# Altium schematic sheet EEM_Connectors.SchDoc: EEM
size 420 x 297 mm; EDA_Number: ARTIQ; SPICEModelCacheVGBTAUBO: <root> / <DocumentId>VGBTAUBO</DocumentId> / </root>; CheckedBy: P.Kulik; Author: G.Kasprowicz; CompanyName: WUT ISE; DrawnBy: G.Kasprowicz; Organization: WUT ISE; Address1: PW ISE; Address2: Nowowiejska 15/19 00-665 Warsaw; Address3: gkasprow@gmail.com; Revision: 2; SheetNumber: -; SheetTotal: -; ModifiedBy: -; CheckedDate: -; Title2: Connectors; DivGrp: WUT ISE; Designer: G.Kasprowicz; ModifiedDate: -; ProjectName: Sensor Box
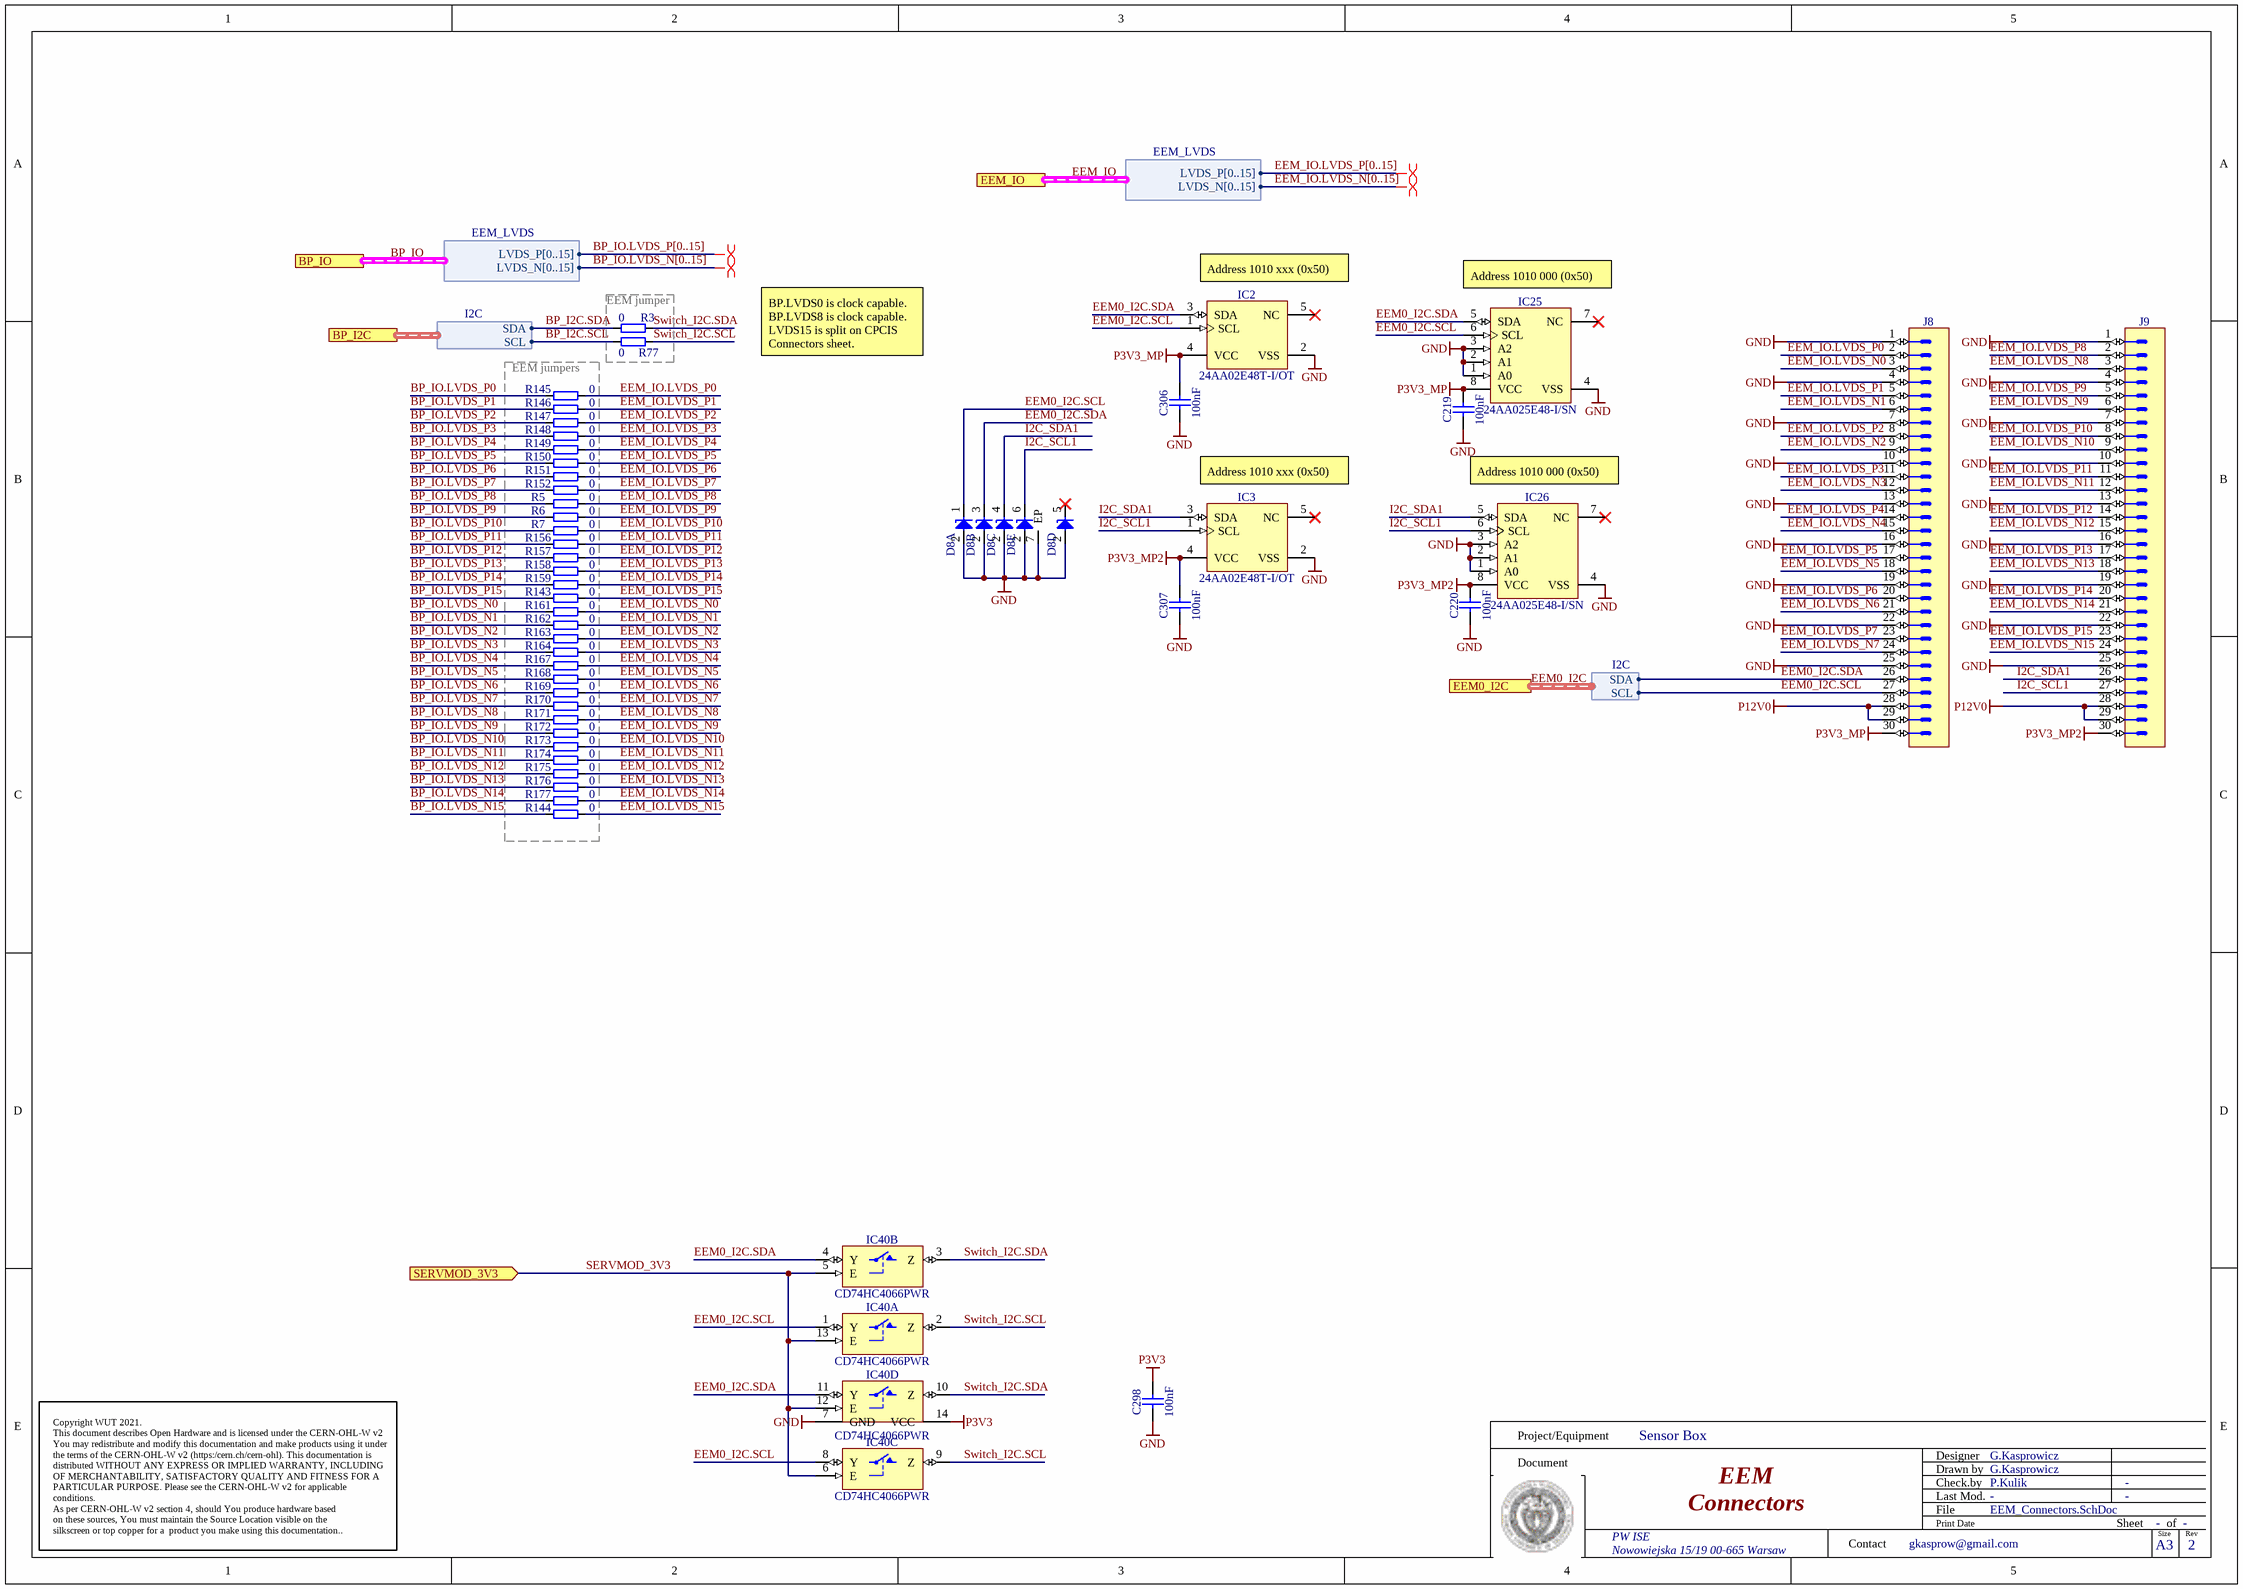
[diagram p0: EEM_Connectors.SchDoc]

## Parts
C219  100nF  [CAPC1005X55N]
C220  100nF  [CAPC1005X55N]
C298  100nF  [CAPC1005X55N]
C306  100nF  [CAPC1005X55N]
C307  100nF  [CAPC1005X55N]
D8  UCLAMP3305P.TCT  [SON50P160X65_HS-7N]  (value not drawn)  (parts A,B,C,D,E of 5)
IC2  24AA02E48T-I/OT  [SOT95P280X145-5N]
IC3  24AA02E48T-I/OT  [SOT95P280X145-5N]
IC25  24AA025E48-I/SN  [SOIC127P600X175-8N]
IC26  24AA025E48-I/SN  [SOIC127P600X175-8N]
IC40  CD74HC4066PWR  [CD74HC4066PWR]  (parts A,B,C,D of 4)
J8  (no value)  [3M_N2530-6002RB]
J9  (no value)  [3M_N2530-6002RB]
R3  0  [RESC1005X40N]
R5  0  [RESC1005X40N]
R6  0  [RESC1005X40N]
R7  0  [RESC1005X40N]
R77  0  [RESC1005X40N]
R143  0  [RESC1005X40N]
R144  0  [RESC1005X40N]
R145  0  [RESC1005X40N]
R146  0  [RESC1005X40N]
R147  0  [RESC1005X40N]
R148  0  [RESC1005X40N]
R149  0  [RESC1005X40N]
R150  0  [RESC1005X40N]
R151  0  [RESC1005X40N]
R152  0  [RESC1005X40N]
R156  0  [RESC1005X40N]
R157  0  [RESC1005X40N]
R158  0  [RESC1005X40N]
R159  0  [RESC1005X40N]
R161  0  [RESC1005X40N]
R162  0  [RESC1005X40N]
R163  0  [RESC1005X40N]
R164  0  [RESC1005X40N]
R167  0  [RESC1005X40N]
R168  0  [RESC1005X40N]
R169  0  [RESC1005X40N]
R170  0  [RESC1005X40N]
R171  0  [RESC1005X40N]
R172  0  [RESC1005X40N]
R173  0  [RESC1005X40N]
R174  0  [RESC1005X40N]
R175  0  [RESC1005X40N]
R176  0  [RESC1005X40N]
R177  0  [RESC1005X40N]

## Blocks framed on the sheet
EEM jumper: R3 R77
EEM jumpers: R5-R7 R143-R152 R156-R159 R161-R164 R167-R177

## Ports
BP_I2C (harness I2C), BP_IO (harness EEM_LVDS), EEM0_I2C (harness I2C), EEM_IO (harness EEM_LVDS), SERVMOD_3V3 (in)

## Harnesses
I2C: SDA, SCL
EEM_LVDS: LVDS_P[0..15], LVDS_N[0..15]

## Nets
GND: C219.1 C220.1 C298.1 C306.1 C307.1 D8.2(A) D8.7(EP) IC2.2(VSS) IC3.2(VSS) IC25.1(A0) IC25.2(A1) IC25.3(A2) IC25.4(VSS) IC26.1(A0) IC26.2(A1) IC26.3(A2) IC26.4(VSS) IC40.7(GND) J8.1 J8.4 J8.7 J8.10 J8.13 J8.16 J8.19 J8.22 J8.25 J9.1 J9.4 J9.7 J9.10 J9.13 J9.16 J9.19 J9.22 J9.25
P3V3: C298.2 IC40.14(VCC)
P3V3_MP: C219.2 C306.2 IC2.4(VCC) IC25.8(VCC) J8.30
P3V3_MP2: C220.2 C307.2 IC3.4(VCC) IC26.8(VCC) J9.30
P12V0: J8.28 J8.29 J9.28 J9.29
BP_I2C.SCL: R77.1 ; port BP_I2C.SCL
BP_I2C.SDA: R3.1 ; port BP_I2C.SDA
BP_IO.LVDS_N0: R161.1
BP_IO.LVDS_N1: R162.1
BP_IO.LVDS_N2: R163.1
BP_IO.LVDS_N3: R164.1
BP_IO.LVDS_N4: R167.1
BP_IO.LVDS_N5: R168.1
BP_IO.LVDS_N6: R169.1
BP_IO.LVDS_N7: R170.1
BP_IO.LVDS_N8: R171.1
BP_IO.LVDS_N9: R172.1
BP_IO.LVDS_N10: R173.1
BP_IO.LVDS_N11: R174.1
BP_IO.LVDS_N12: R175.1
BP_IO.LVDS_N13: R176.1
BP_IO.LVDS_N14: R177.1
BP_IO.LVDS_N15: R144.2
BP_IO.LVDS_P0: R145.1
BP_IO.LVDS_P1: R146.1
BP_IO.LVDS_P2: R147.1
BP_IO.LVDS_P3: R148.1
BP_IO.LVDS_P4: R149.1
BP_IO.LVDS_P5: R150.1
BP_IO.LVDS_P6: R151.1
BP_IO.LVDS_P7: R152.1
BP_IO.LVDS_P8: R5.1
BP_IO.LVDS_P9: R6.1
BP_IO.LVDS_P10: R7.1
BP_IO.LVDS_P11: R156.1
BP_IO.LVDS_P12: R157.1
BP_IO.LVDS_P13: R158.1
BP_IO.LVDS_P14: R159.1
BP_IO.LVDS_P15: R143.2
EEM0_I2C.SCL: D8.1(C) IC2.1(SCL) IC25.6(SCL) IC40.1(Y) IC40.8(Y) J8.27 ; port EEM0_I2C.SCL
EEM0_I2C.SDA: D8.3(C) IC2.3(SDA) IC25.5(SDA) IC40.4(Y) IC40.11(Y) J8.26 ; port EEM0_I2C.SDA
EEM_IO.LVDS_N0: J8.3 R161.2
EEM_IO.LVDS_N1: J8.6 R162.2
EEM_IO.LVDS_N2: J8.9 R163.2
EEM_IO.LVDS_N3: J8.12 R164.2
EEM_IO.LVDS_N4: J8.15 R167.2
EEM_IO.LVDS_N5: J8.18 R168.2
EEM_IO.LVDS_N6: J8.21 R169.2
EEM_IO.LVDS_N7: J8.24 R170.2
EEM_IO.LVDS_N8: J9.3 R171.2
EEM_IO.LVDS_N9: J9.6 R172.2
EEM_IO.LVDS_N10: J9.9 R173.2
EEM_IO.LVDS_N11: J9.12 R174.2
EEM_IO.LVDS_N12: J9.15 R175.2
EEM_IO.LVDS_N13: J9.18 R176.2
EEM_IO.LVDS_N14: J9.21 R177.2
EEM_IO.LVDS_N15: J9.24 R144.1
EEM_IO.LVDS_P0: J8.2 R145.2
EEM_IO.LVDS_P1: J8.5 R146.2
EEM_IO.LVDS_P2: J8.8 R147.2
EEM_IO.LVDS_P3: J8.11 R148.2
EEM_IO.LVDS_P4: J8.14 R149.2
EEM_IO.LVDS_P5: J8.17 R150.2
EEM_IO.LVDS_P6: J8.20 R151.2
EEM_IO.LVDS_P7: J8.23 R152.2
EEM_IO.LVDS_P8: J9.2 R5.2
EEM_IO.LVDS_P9: J9.5 R6.2
EEM_IO.LVDS_P10: J9.8 R7.2
EEM_IO.LVDS_P11: J9.11 R156.2
EEM_IO.LVDS_P12: J9.14 R157.2
EEM_IO.LVDS_P13: J9.17 R158.2
EEM_IO.LVDS_P14: J9.20 R159.2
EEM_IO.LVDS_P15: J9.23 R143.1
I2C_SCL1: D8.6(C) IC3.1(SCL) IC26.6(SCL) J9.27
I2C_SDA1: D8.4(C) IC3.3(SDA) IC26.5(SDA) J9.26
SERVMOD_3V3: IC40.5(E) IC40.6(E) IC40.12(E) IC40.13(E) ; port SERVMOD_3V3
Switch_I2C.SCL: IC40.2(Z) IC40.9(Z) R77.2
Switch_I2C.SDA: IC40.3(Z) IC40.10(Z) R3.2

Not connected (* = marked no-connect by the designer): D8 5(C)*; IC2 5(NC)*; IC3 5(NC)*; IC25 7(NC)*; IC26 7(NC)*

## Buses and harness runs
bus BP_IO.LVDS_N[0..15]
bus BP_IO.LVDS_P[0..15]
bus EEM_IO.LVDS_N[0..15]
bus EEM_IO.LVDS_P[0..15]
harness BP_IO = port BP_IO
harness EEM0_I2C = port EEM0_I2C
harness EEM_IO = port EEM_IO

## Layout directives
differential pair; differential pair class Diff_100Ohm: (no net found under the mark)

## Notes on the sheet
- (near IC2) Address 1010 xxx (0x50)
- (near IC25) Address 1010 000 (0x50)
- BP.LVDS0 is clock capable.
  BP.LVDS8 is clock capable.
  LVDS15 is split on CPCIS Connectors sheet.
- Address 1010 xxx (0x50)
- Address 1010 000 (0x50)
- Project/Equipment
- Document
- Designer
- Drawn by
- Check.by
- Contact
- File
- Last Mod.
- Print Date
- Sheet
- Size
- A3
- of
- Rev
- Copyright WUT 2021.
  This document describes Open Hardware and is licensed under the CERN-OHL-W v2
  You may redistribute and modify this documentation and make products using it under the terms of the CERN-OHL-W v2 (https:/cern.ch/cern-ohl). This documentation is distributed WITHOUT ANY EXPRESS OR IMPLIED WARRANTY, INCLUDING OF MERCHANTABILITY, SATISFACTORY QUALITY AND FITNESS FOR A PARTICULAR PURPOSE. Please see the CERN-OHL-W v2 for applicable conditions.
  As per CERN-OHL-W v2 section 4, should You produce hardware based
  on these sources, You must maintain the Source Location visible on the
  silkscreen or top copper for a  product you make using this documentation..

## Library data of the parts
C219 C220 C298 C306 C307 = CC0402_100NF_50V_10%_X7R: Non-polarised capacitor; Part Description: SMD Multilayer Chip Ceramic Capacitor; Manufacturer: GENERIC; Manufacturer1 Part Number: GRM155R71H104KE14D; Voltage: 50V; TC: X7R; Tolerance: ±10%; Part Number: CC0402_100NF_50V_10%_X7R; Component Kind: Standard; Component Type: Standard; Pin Count: 2; Value: 100nF; Status: None; Manufacturer Part Number: CC0402_100NF_50V_10%_X7R; Case: 0402; Mounted: Yes; Socket: No; SMD: Yes; Sense: No; HelpURL: \\cern.ch\dfs\Applications\Altium\Datasheets\CC0402_MURATA_GRM155R71H104KE14D.pdf; Author: CERN DEM MR; CreateDate: 30.06.2017; LatestRevisionDate: 30.06.2017; Manufacturer1 Example: MURATA; Manufacturer1 ComponentHeight: 0.55mm
D8 = CMP-004-00037-2: Diode TVS Quint Common Anode Uni-Dir 3.3V 40W 6-Pin SLP EP T/R; Max Operating Temperature: 125°C; Min Operating Temperature: -55°C; Pins: 6; Mounting Technology: Surface Mount
IC2 IC3 = 24AA02E48T-I/OT: 1.7V-5.5V, 2K I2C Serial EEPROM With EUI-48 Node Identity; Manufacturer: MICROCHIP TECHNOLOGY; PressFit: No; Bonding: No; Part Number: 24AA02E48T-I/OT; Component Kind: Standard; Component Type: Standard; Device: 24AA02E48T-I/OT; PackageDescription: SOT, 0.95mm pitch; 5 pin, 1.60mm W X 2.90mm L X 1.45mm H body, IPC Medium Density; Part Description: 1.7V-5.5V, 2K I2C Serial EEPROM with EUI-48 Node Identity; Manufacturer Part Number: 24AA02E48T-I/OT; Pin Count: 5; Case: SOT23-5; Mounted: Yes; Socket: No; SMD: Yes; Sense: No; ComponentHeight: 1.45mm; HelpURL: \\cern.ch\dfs\Applications\Altium\Datasheets\24AA02E48T-I-OT.pdf; Author: CERN DEM MR; CreateDate: 31.03.2016; LatestRevisionDate: 31.03.2016
IC25 IC26 = 24AA025E48-I/SN: 1.7V-5.5V, 2K I2C™ Serial EEPROMs with EUI-48™ Node Identity; Manufacturer: MICROCHIP TECHNOLOGY; PressFit: No; Bonding: No; Part Number: 24AA025E48-I/SN; Component Kind: Standard; Component Type: Standard; Device: 24AA025E48-I/SN; PackageDescription: SOIC 8, Pitch 1.27mm - Body 4x5mm, IPC Medium Density; Part Description: 1.7V-5.5V, 2K I2C™ Serial EEPROMs with EUI-48™ Node Identity; Manufacturer Part Number: 24AA025E48-I/SN; Pin Count: 8; Case: SOIC8; Mounted: Yes; Socket: No; SMD: Yes; Sense: No; ComponentHeight: 1.75mm; HelpURL: \\cern.ch\dfs\Applications\Altium\Datasheets\24AA025E48-I-SN.pdf; Author: CERN DEM MR; CreateDate: 19.07.2016; LatestRevisionDate: 19.07.2016
IC40 = CMP-016-00739-2: 12-V, 1: 1 (SPST), (SPST), 4-channel analog switch 14-TSSOP -55 to 125; Min Supply Voltage: 2V; Max Supply Voltage: 10V; Mounting Technology: Surface Mount; Min Operating Temperature: -55°C; Case/Package: TSSOP; Pins: 14; Max Operating Temperature: 125°C
J8 J9 = 3M_N2530-6002RB: Connector 30 Male; Part Description: 30 Contacts - Straight .100'' x .100'' Low Profile Four-Wall Header, 2500 Series; Manufacturer: 3M; PressFit: No; Part Number: 3M_N2530-6002RB; Component Kind: Standard; Component Type: Standard; Pin Count: 30; Family: Header 30; Mounted: Yes; Socket: No; SMD: No; Sense: No; Status: None; Manufacturer Part Number: N2530-6002RB; ComponentHeight: 10.03mm; HelpURL: \\cern.ch\dfs\Applications\Altium\Datasheets\3M_N2530-6002RB.pdf; Author: CERN DEM JLC; CreateDate: 11.02.2009; LatestRevisionDate: 11.08.2009
R3 R5-R7 R77 R143-R152 R156-R159 R161-R164 R167-R177 = R0402_0R_JUMPER: Resistor; Part Description: 1A (0.05R Max DC Resistance) Zero Ohm Jumper; Manufacturer: GENERIC; Manufacturer1 Part Number: 232270591001L; PressFit: No; Part Number: R0402_0R_JUMPER; Component Kind: Standard; Component Type: Standard; Pin Count: 2; Value: 0; Status: Not Recommended; Manufacturer Part Number: R0402_0R_JUMPER; Case: 0402; Mounted: Yes; Sense: No; Socket: No; SMD: Yes; Manufacturer1 Example: YAGEO PHYCOMP; Manufacturer1 ComponentHeight: 0.4mm; HelpURL: \\cern.ch\dfs\Applications\Altium\Datasheets\R0402_Phycomp_RC0402.pdf; Author: CERN DEM JLC; CreateDate: 03.12.2007; LatestRevisionDate: 17.10.2012